# Altium schematic sheet CLOCKING.SchDoc: CLOCKING
size A3; Date: 2011-11-28; Author: S.Choquette; Revision: 2.0; SheetNumber: 5; SheetTotal: 9
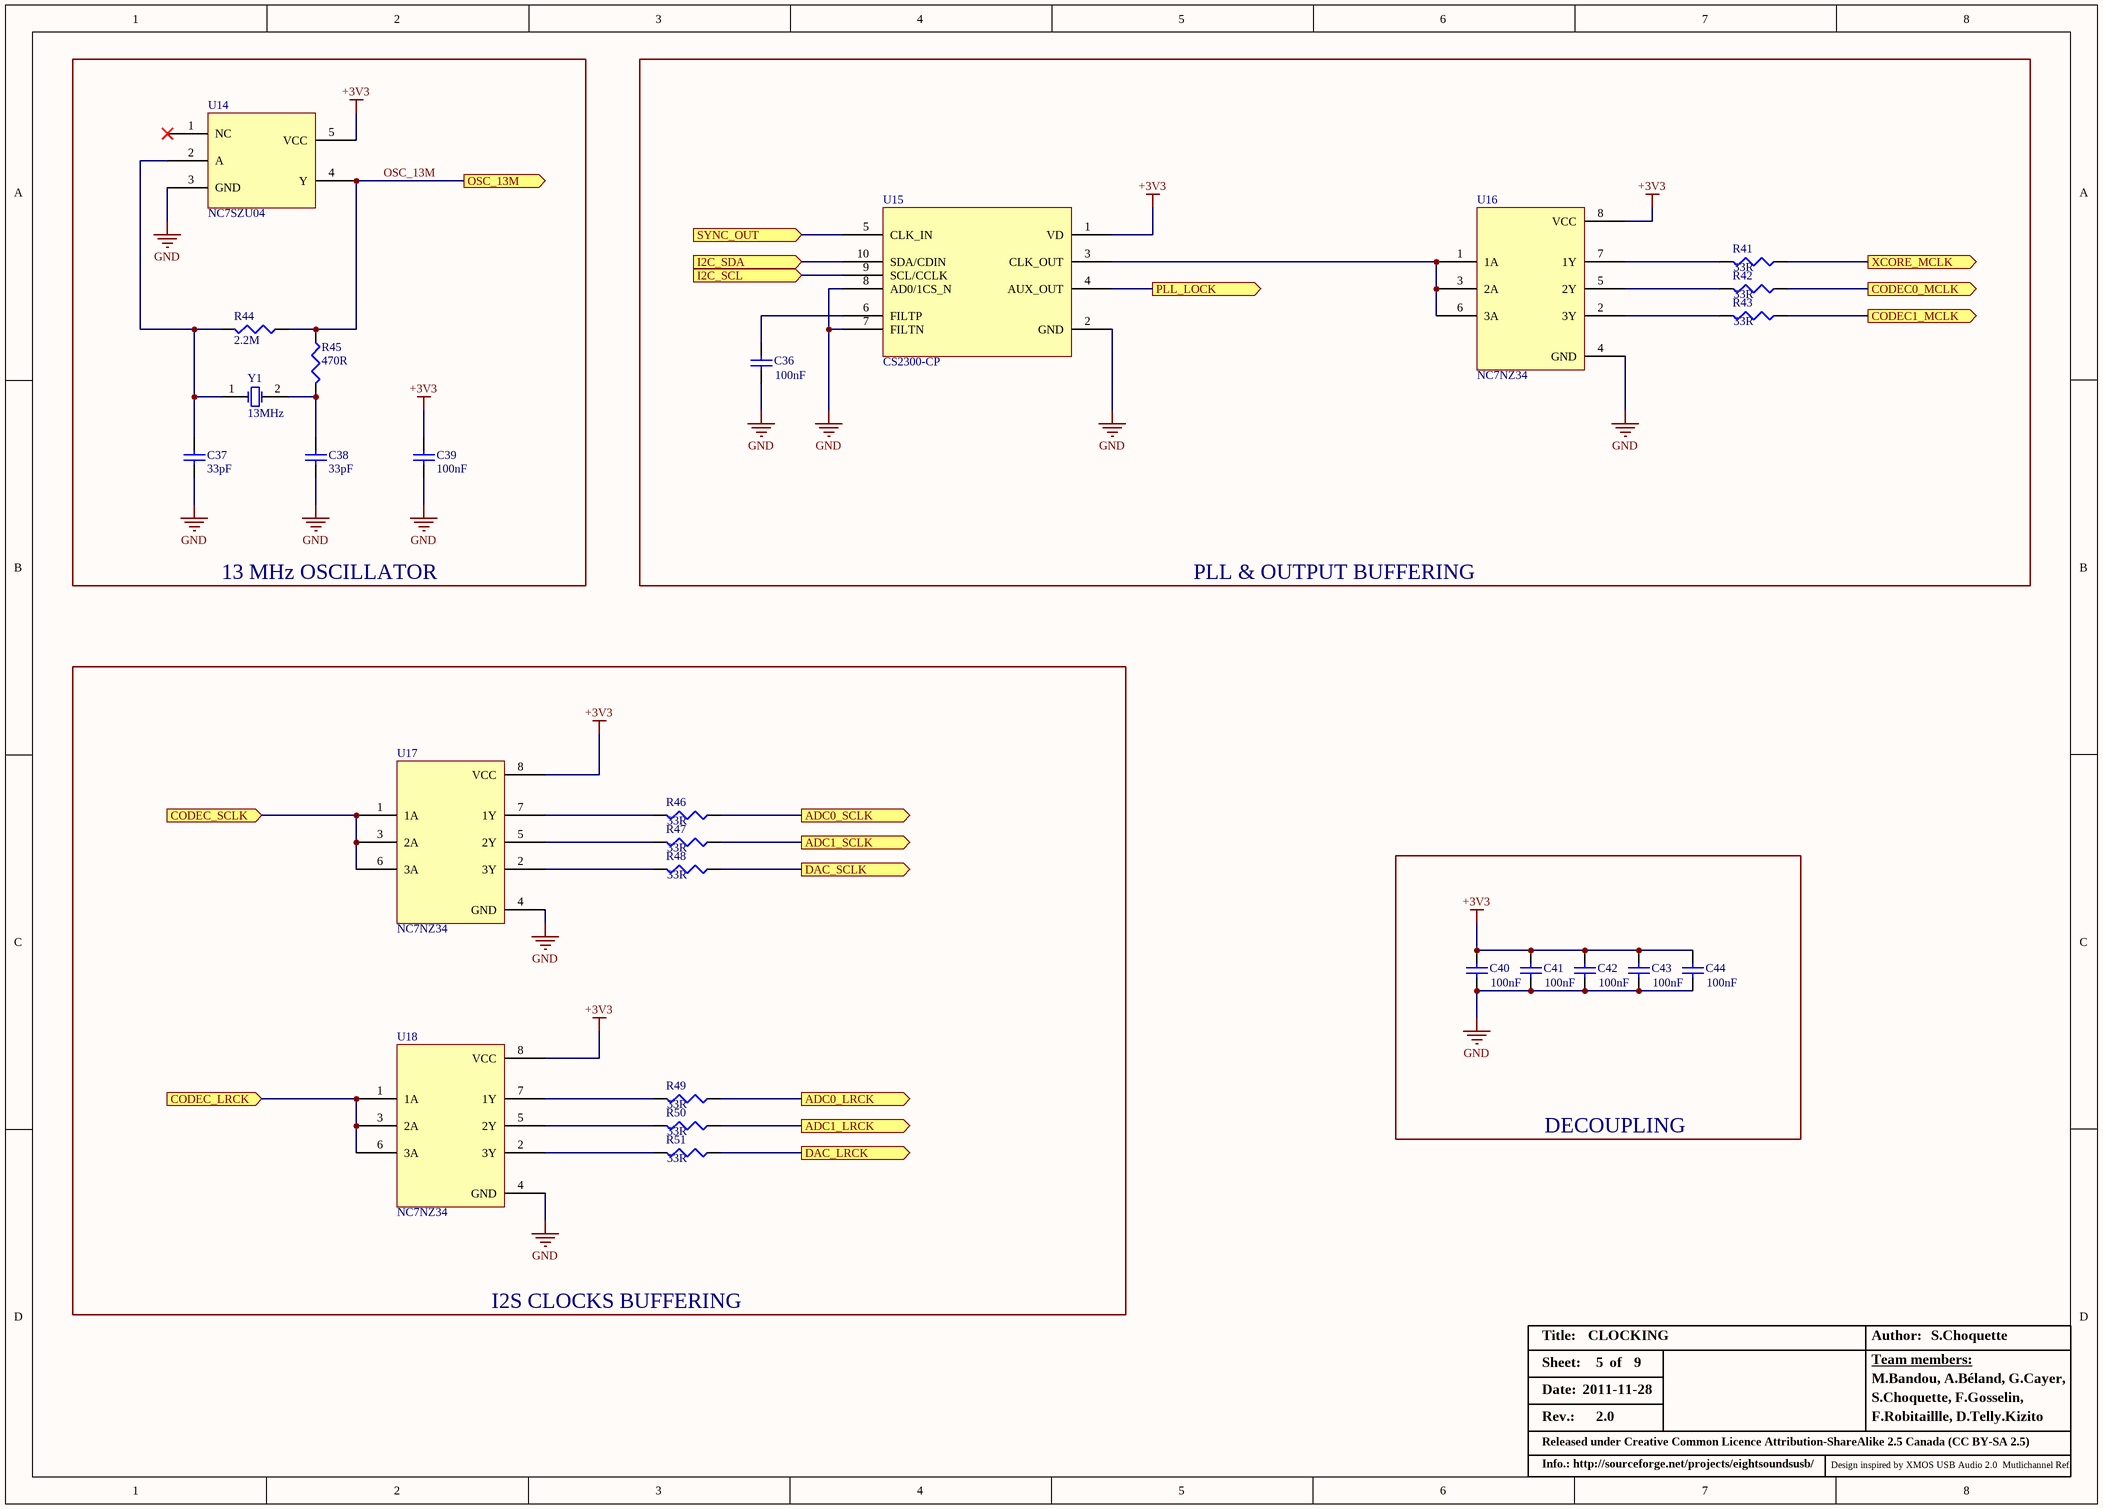
[diagram p0: CLOCKING.SchDoc]

## Parts
C36  value 100nF  [2-0402]
C37  value 33pF  [3-0603]
C38  value 33pF  [3-0603]
C39  value 100nF  [3-0603]
C40  value 100nF  [2-0402]
C41  value 100nF  [2-0402]
C42  value 100nF  [2-0402]
C43  value 100nF  [2-0402]
C44  value 100nF  [2-0402]
R41  value 33R  [3-0603]
R42  value 33R  [3-0603]
R43  value 33R  [3-0603]
R44  value 2.2M  [3-0603]
R45  value 470R  [3-0603]
R46  value 33R  [3-0603]
R47  value 33R  [3-0603]
R48  value 33R  [3-0603]
R49  value 33R  [3-0603]
R50  value 33R  [3-0603]
R51  value 33R  [3-0603]
U14  NC7SZU04  [SOT23-5AL_MOD(1-07-26)]
U15  CS2300-CP  [TSSOP50P490-10AL]
U16  NC7NZ34  [NC7NZ34]
U17  NC7NZ34  [NC7NZ34]
U18  NC7NZ34  [NC7NZ34]
Y1  13MHz  [X_TAL]

## Blocks framed on the sheet
13 MHz OSCILLATOR: C37-C39 R44 R45 U14 Y1
PLL & OUTPUT BUFFERING: C36 R41-R43 U15 U16
I2S CLOCKS BUFFERING: R46-R51 U17 U18
DECOUPLING: C40-C44

## Ports
ADC0_LRCK (out), ADC0_SCLK (out), ADC1_LRCK (out), ADC1_SCLK (out), CODEC0_MCLK (out), CODEC1_MCLK (out), CODEC_LRCK (in), CODEC_SCLK (in), DAC_LRCK (out), DAC_SCLK (out), I2C_SCL (in), I2C_SDA (in), OSC_13M (out), PLL_LOCK (out), SYNC_OUT (in), XCORE_MCLK (out)

## Nets
+3V3: C39.2 C40.2 C41.2 C42.2 C43.2 C44.2 U14.5(VCC) U15.1(VD) U16.8(VCC) U17.8(VCC) U18.8(VCC)
GND: C36.1 C37.1 C38.1 C39.1 C40.1 C41.1 C42.1 C43.1 C44.1 U14.3(GND) U15.2(GND) U15.7(FILTN) U15.8(AD0/1CS_N) U16.4(GND) U17.4(GND) U18.4(GND)
ADC0_LRCK: R49.1 ; port ADC0_LRCK
ADC0_SCLK: R46.1 ; port ADC0_SCLK
ADC1_LRCK: R50.1 ; port ADC1_LRCK
ADC1_SCLK: R47.1 ; port ADC1_SCLK
CODEC0_MCLK: R42.1 ; port CODEC0_MCLK
CODEC1_MCLK: R43.1 ; port CODEC1_MCLK
CODEC_LRCK: U18.1(1A) U18.3(2A) U18.6(3A) ; port CODEC_LRCK
CODEC_SCLK: U17.1(1A) U17.3(2A) U17.6(3A) ; port CODEC_SCLK
DAC_LRCK: R51.1 ; port DAC_LRCK
DAC_SCLK: R48.1 ; port DAC_SCLK
I2C_SCL: U15.9(SCL/CCLK) ; port I2C_SCL
I2C_SDA: U15.10(SDA/CDIN) ; port I2C_SDA
OSC_13M: R44.1 R45.1 U14.4(Y) ; port OSC_13M
PLL_LOCK: U15.4(AUX_OUT) ; port PLL_LOCK
SYNC_OUT: U15.5(CLK_IN) ; port SYNC_OUT
XCORE_MCLK: R41.1 ; port XCORE_MCLK
NetC36_2: C36.2 U15.6(FILTP)
NetC37_2: C37.2 R44.2 U14.2(A) Y1.1(OSC1)
NetC38_2: C38.2 R45.2 Y1.2(OSC2)
NetR41_2: R41.2 U16.7(1Y)
NetR42_2: R42.2 U16.5(2Y)
NetR43_2: R43.2 U16.2(3Y)
NetR46_2: R46.2 U17.7(1Y)
NetR47_2: R47.2 U17.5(2Y)
NetR48_2: R48.2 U17.2(3Y)
NetR49_2: R49.2 U18.7(1Y)
NetR50_2: R50.2 U18.5(2Y)
NetR51_2: R51.2 U18.2(3Y)
NetU15_3: U15.3(CLK_OUT) U16.1(1A) U16.3(2A) U16.6(3A)

Not connected (* = marked no-connect by the designer): U14 1(NC)*

## Notes on the sheet
- Title:
- Date:
- Sheet:
- of
- Author:
- Team members:
- M.Bandou, A.Béland, G.Cayer,
- Rev.:
- Released under Creative Common Licence Attribution-ShareAlike 2.5 Canada (CC BY-SA 2.5)
- S.Choquette, F.Gosselin,
- F.Robitaillle, D.Telly.Kizito
- Info.: http://sourceforge.net/projects/eightsoundsusb/
- Design inspired by XMOS USB Audio 2.0  Mutlichannel Ref.

## Library data of the parts
C36 C40-C44 = Cap: MLCC 100nF 0402 X7R 16V; Manufacturer: Murata; Part Number: GRM155R71C104KA88; Cost: 0,005
C37 C38 = Cap: MLCC 33pF 0603 COG 50V; Manufacturer: Murata; Part Number: GRM1885C1H330JA01; Cost: 0,005
C39 = Cap: MLCC 100nF 0603 X7R 16V; Manufacturer: Murata; Part Number: GRM188R71C104KA01; Cost: 0,005
R41-R43 R46-R51 = Res3: RES 33R 0603 1%; Manufacturer: ROHM; Part Number: MCR03EZPFX33R0; Cost: *
R44 = Res3: RES 2.2M 0603 5%; Manufacturer: ROHM; Part Number: MCR03EZPJ225; Cost: *
R45 = Res3: RES 470R 0603 1%; Manufacturer: ROHM; Part Number: MCR03EZPFX4700; Cost: *
U14 = NC7SZU04: TinyLogic UHS Unbuffered Inverter; Manufacturer: Fairchild; Part Number: NC7SZU04M5X; Cost: *
U15 = CS2300-CP: Fractional-N Clock Multiplier with Internal LCO; Manufacturer: Cirrus Logic; Part Number: CS2300-CP; Cost: *
U16-U18 = NC7NZ34: TinyLogic UHS Triple Buffer; Part Number: NC7NZ34K8X; Manufacturer: Fairchild; Cost: *
Y1 = XTAL: Crystal, 13MHz, HC49/US SMD, Fundamental, 18pF, Tol. ±30ppm, Stab. ±30ppm; Manufacturer: Abracon; Part Number: ABLS2-13.000MHz-D4Y; Cost: *